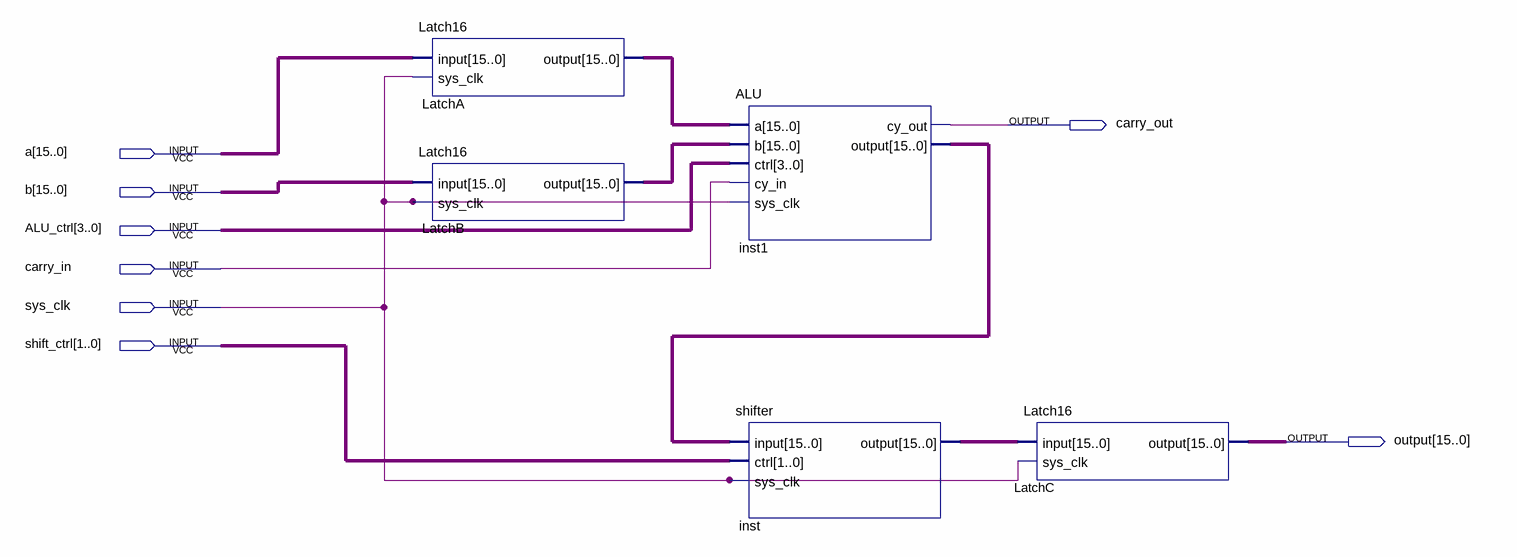
[diagram p0: schematic sheet]
// Quartus schematic LatchALUShifter.bdf as structural Verilog: 5 symbols, 8 pins
module LatchALUShifter (
  input  [15:0] a,
  input  [15:0] b,
  input  [3:0] ALU_ctrl,
  input  carry_in,
  input  sys_clk,
  input  [1:0] shift_ctrl,
  output carry_out,
  output [15:0] \output 
);

  wire [15:0] inst1_output, inst_output, LatchA_output, LatchB_output;

  Latch16 LatchA (.\input (a), .sys_clk(sys_clk), .\output (LatchA_output));
  Latch16 LatchB (.\input (b), .sys_clk(sys_clk), .\output (LatchB_output));
  ALU inst1 (
    .a(LatchA_output), .b(LatchB_output), .ctrl(ALU_ctrl), .cy_in(carry_in), .sys_clk(sys_clk),
    .cy_out(carry_out), .\output (inst1_output));
  shifter inst (.\input (inst1_output), .ctrl(shift_ctrl), .sys_clk(sys_clk), .\output (inst_output));
  Latch16 LatchC (.\input (inst_output), .sys_clk(sys_clk), .\output (\output ));
endmodule
